# EAGLE design Number (EAGLE 7.3.0)
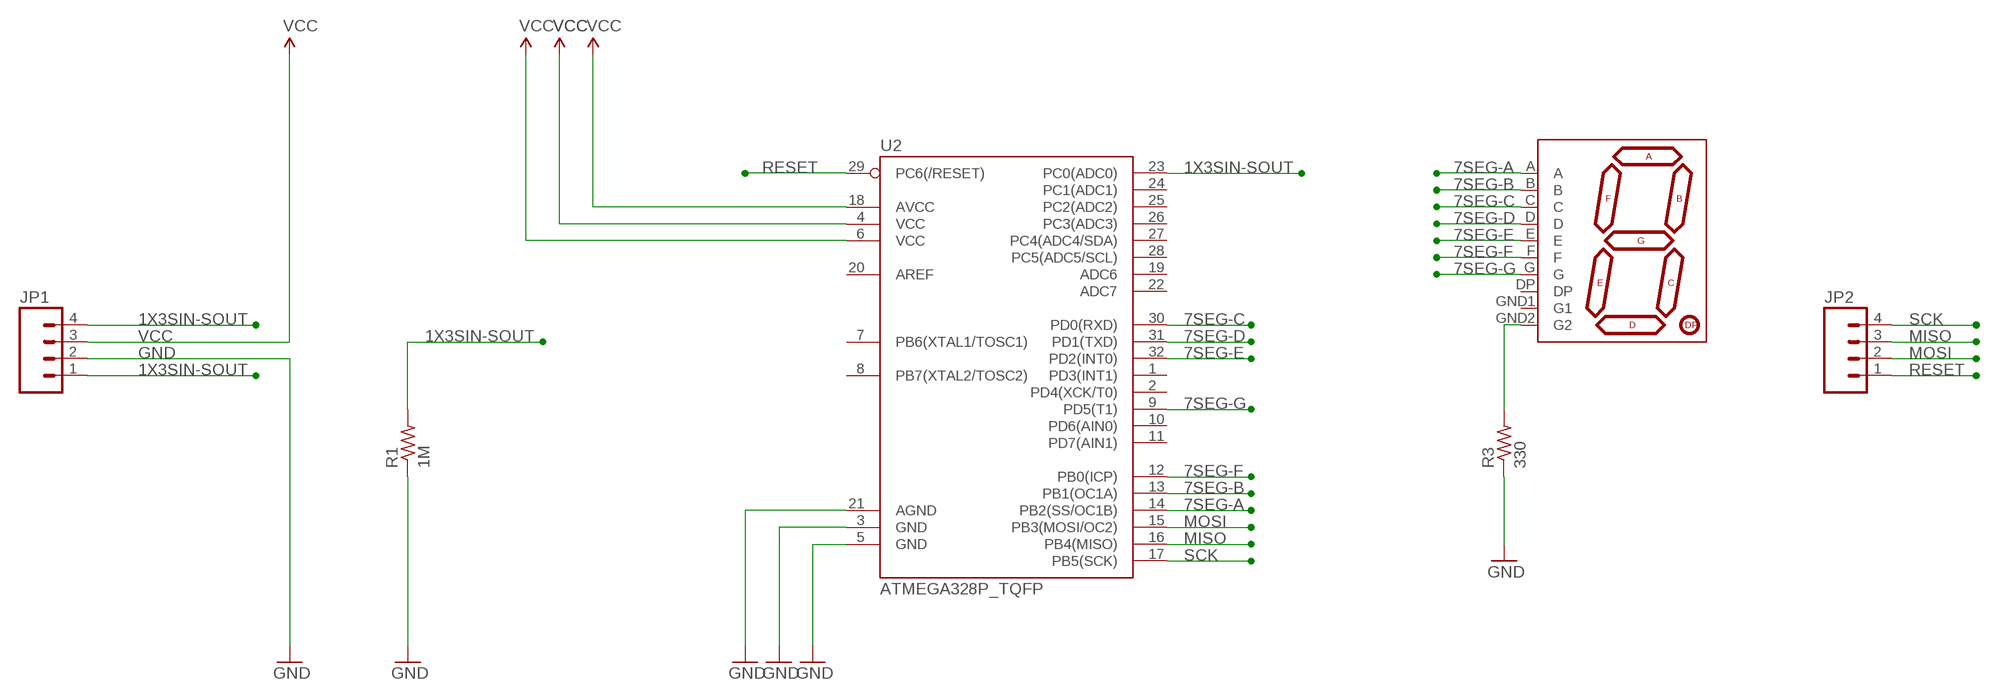
[diagram p0: schematic, sheet 1]

## Parts
JP1  M04PTH  [1X04]
JP2  M04PTH  [1X04]
R1  1M  R-US_R0603  [R0603]
R3  330  R-US_R0603  [R0603]
U2  ATMEGA328P_TQFP  [TQFP32-08]
U$1  7SEGMENT  [7SEG-SMD-10X7.3]

## Nets
1X3SIN-SOUT: JP1.1 JP1.4 R1.2 U2.23(PC0(ADC0))
7SEG-A: U2.14(PB2(SS/OC1B)) U$1.A
7SEG-B: U2.13(PB1(OC1A)) U$1.B
7SEG-C: U2.30(PD0(RXD)) U$1.C
7SEG-D: U2.31(PD1(TXD)) U$1.D
7SEG-E: U2.32(PD2(INT0)) U$1.E
7SEG-F: U2.12(PB0(ICP)) U$1.F
7SEG-G: U2.9(PD5(T1)) U$1.G
GND: JP1.2 R1.1 R3.1 U2.3(GND) U2.5(GND) U2.21(AGND)
MISO: JP2.3 U2.16(PB4(MISO))
MOSI: JP2.2 U2.15(PB3(MOSI/OC2))
N$1: R3.2 U$1.GND2(G2)
RESET: JP2.1 U2.29(PC6(/RESET))
SCK: JP2.4 U2.17(PB5(SCK))
VCC: JP1.3 U2.4(VCC) U2.6(VCC) U2.18(AVCC)
Unconnected: U2.1(PD3(INT1)) U2.2(PD4(XCK/T0)) U2.7(PB6(XTAL1/TOSC1)) U2.8(PB7(XTAL2/TOSC2)) U2.10(PD6(AIN0)) U2.11(PD7(AIN1)) U2.19(ADC6) U2.20(AREF) U2.22(ADC7) U2.24(PC1(ADC1)) U2.25(PC2(ADC2)) U2.26(PC3(ADC3)) U2.27(PC4(ADC4/SDA)) U2.28(PC5(ADC5/SCL)) U$1.DP U$1.GND1(G1)

## Library data of the parts
JP1 JP2 = SparkFun-Connectors:M04: Header 4 Standard 4-pin 0.1" header. Use with straight break away headers (SKU : PRT-00116), right angle break away headers (PRT-00553), swiss pins (PRT-00743), machine pins (PRT-00117), and female headers (PRT-00115). Molex polarized connector foot print use with SKU : PRT-08231 with associated crimp pins and housings. 1MM SMD Version SKU: PRT-10208
R1 = adafruit:R-US_: RESISTOR, American symbol
R3 = resistor:R-US_: RESISTOR, American symbol
U2 = SparkFun-DigitalIC:ATMEGA328P_TQFP; PROD_ID: IC-09069
U$1 = MakerWear:7SEGMENT

## Board
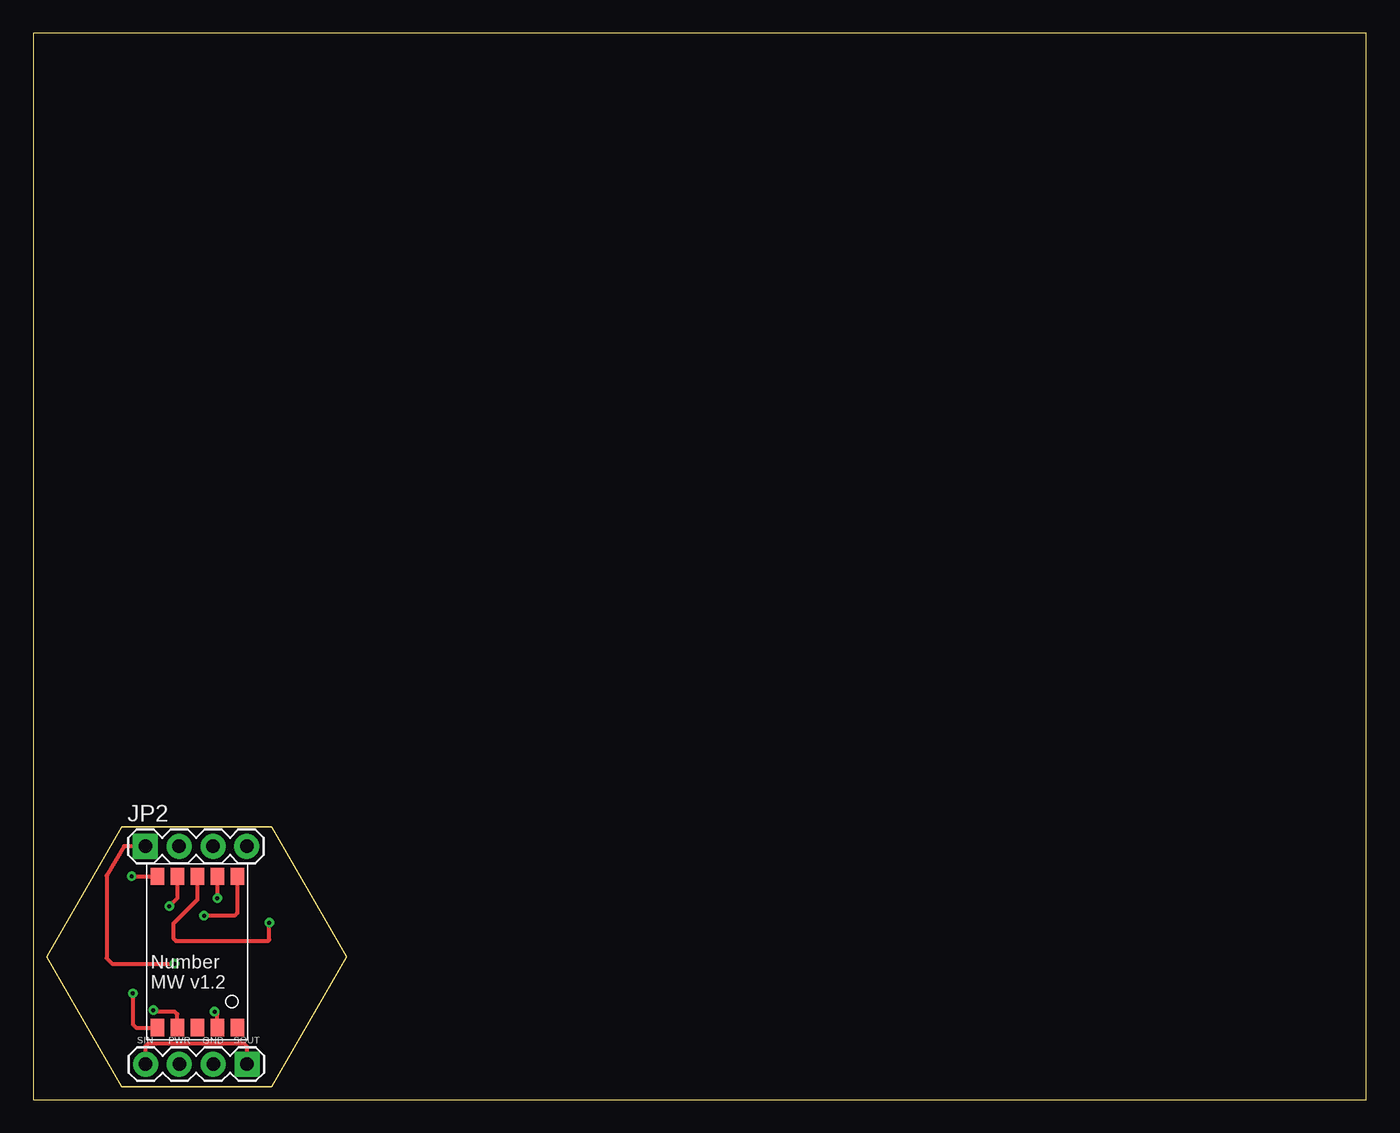
[diagram p1: board, top side]
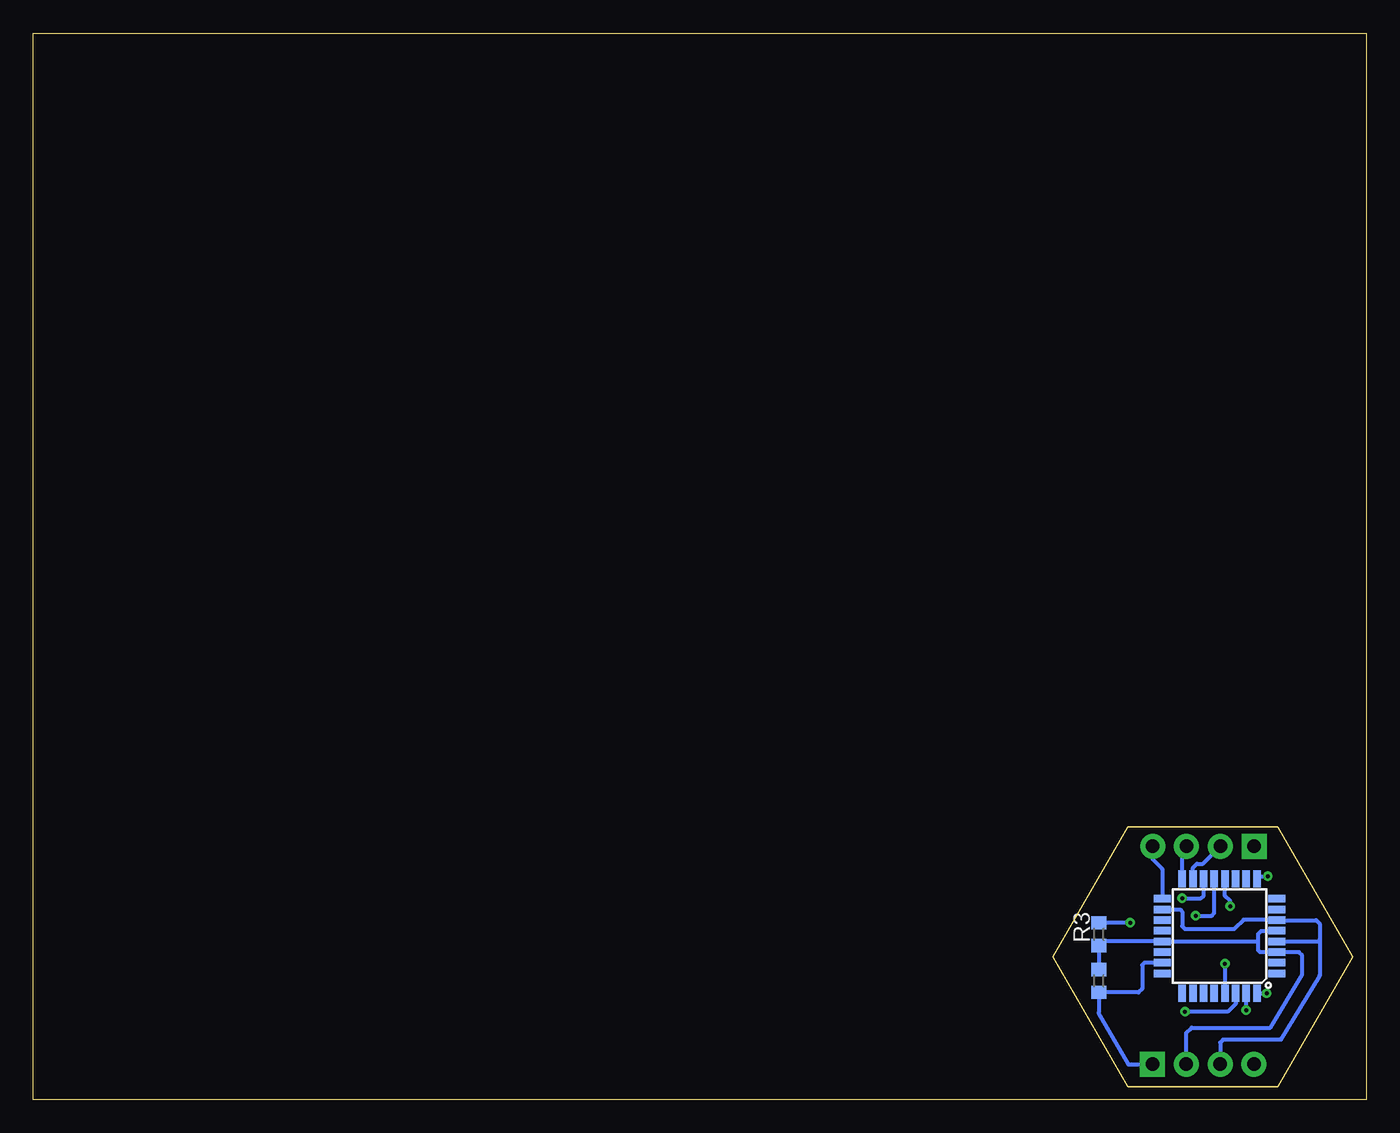
[diagram p2: board, bottom side, seen from below]

Size 100 x 80 mm. Coordinates in mm from the lower left corner, seen from the top.
Outline: 0,0 100,0 100,80 0,80 0,0
Outline: 23.49,10.7 17.86,0.96 6.61,0.96 0.99,10.7 6.61,20.44 17.86,20.44 23.49,10.7
Copper layers (1*16): Top 0.035mm / dielectric 1.5mm / Bottom 0.035mm
Design rules "default *": minimum track width 10mil, minimum drill 24mil, track to track 8mil, track to pad 8mil, pad to pad 8mil, via to via 8mil, smd to smd 8mil, copper to edge 0mil, drill to drill 8mil, minimum pad ring 10mil, minimum via ring 8mil, stop-mask expansion 4mil, vias tented up to drill 0mil, thermal gap 10mil

### Footprints (pad centres in the part's own frame; a part is rotated, then mirrored left to right if it is on the bottom)
1X04 = drill 1.016 pad 1.88 square: 1 0,0 | drill 1.016 pad 1.88: 2 2.54,0; 3 5.08,0; 4 7.62,0
R0603 = smd 1 x 1.1: 1 -0.85,0; 2 0.85,0
TQFP32-08 = smd 1.27 x 0.559: 1 -4.293,2.8; 2 -4.293,2; 3 -4.293,1.2; 4 -4.293,0.4; 5 -4.293,-0.4; 6 -4.293,-1.2; 7 -4.293,-2; 8 -4.293,-2.8; 17 4.293,-2.8; 18 4.293,-2; 19 4.293,-1.2; 20 4.293,-0.4; 21 4.293,0.4; 22 4.293,1.2; 23 4.293,2; 24 4.293,2.8 | smd 0.559 x 1.27: 9 -2.8,-4.293; 10 -2,-4.293; 11 -1.2,-4.293; 12 -0.4,-4.293; 13 0.4,-4.293; 14 1.2,-4.293; 15 2,-4.293; 16 2.8,-4.293; 25 2.8,4.293; 26 2,4.293; 27 1.2,4.293; 28 0.4,4.293; 29 -0.4,4.293; 30 -1.2,4.293; 31 -2,4.293; 32 -2.8,4.293
7SEG-SMD-10X7.3 = smd 1 x 1.3: A 4.5,11.35; B 6,11.35; C 4.5,0; D 1.5,0; DP 6,0; E 0,0; F 1.5,11.35; G 0,11.35; GND1 3,0; GND2 3,11.35

### Placement (x,y rotation side)
JP1  16.04,2.66 180 top
JP2  8.4,19 0 top
R1  20.06,8.9 270 bottom
R3  20.06,12.41 90 bottom
U2  11,12.26 180 bottom
U$1  9.3,5.4 0 top

### Tracks (layer width: path | path; a pad name or v marks a point on that pad's centre or on a via)
1X3SIN-SOUT
  Top 0.305: JP1.1 16.04,3.96 15.8,4.2 8.6,4.2 8.4,4 8.4,2.68 JP1.4
  Bottom 0.305: JP1.1 17.83,2.64 20.08,6.52 20.06,6.54 R1.2 17.08,8.04 16.8,8.32 16.8,10.1 16.64,10.26 U2.23
7SEG-A  (via drill 0.3 pad 0.25)
  Top 0.305: U$1.A v13.8,15.1
  Bottom 0.305: v13.8,15.1 12.4,15.1 12.2,15.3 U2.14
7SEG-B  (via drill 0.3 pad 0.25)
  Top 0.305: U$1.B 15.3,14 15.1,13.8 v12.8,13.8
  Bottom 0.305: v12.8,13.8 11.6,13.8 11.4,14 U2.13
7SEG-C  (via drill 0.3 pad 0.25)
  Top 0.305: U$1.C 13.8,6.4 v13.6,6.6
  Bottom 0.305: U2.30 9.8,7.2 10.4,6.6 v13.6,6.6
7SEG-D  (via drill 0.3 pad 0.25)
  Top 0.305: U$1.D 10.8,6.4 10.6,6.6 9.2,6.6 v9,6.7
  Bottom 0.305: v9,6.7 U2.31
7SEG-E  (via drill 0.3 pad 0.25)
  Top 0.305: v7.46,7.97 7.46,5.64 7.7,5.4 U$1.E
  Bottom 0.305: U2.32 v7.46,7.97
7SEG-F  (via drill 0.3 pad 0.25)
  Top 0.305: U$1.F 10.8,15.1 v10.2,14.5
  Bottom 0.305: v10.2,14.5 10.2,14.9 10.6,15.3 U2.12
7SEG-G  (via drill 0.3 pad 0.25)
  Top 0.305: v7.38,16.75 U$1.G
  Bottom 0.305: U2.9 8.18,16.75 v7.38,16.75
GND
  Bottom 0.305: R1.1 R3.1 19.76,11.86 U2.21 8.16,11.86 8.1,11.8 | 8.1,11.8 8.1,11.2 7.96,11.06 U2.3 6.7,11.05 5.04,11.05 4.8,10.81 4.8,9.4 7.2,5.4 13.1,5.4 13.5,5 JP1.2 | 8.1,11.8 8.1,12.42 7.87,12.65 U2.5
MISO
  Bottom 0.305: U2.16 13.8,18.68 JP2.3
MOSI
  Bottom 0.305: U2.15 13,17.4 12.7,17.7 12.24,17.7 JP2.2
N$1  (via drill 0.3 pad 0.25)
  Top 0.305: U$1.GND2 12.3,15 10.5,13.2 10.5,12.1 10.7,11.9 17.6,11.9 17.7,12 v17.7,13.25 v17.71,13.26
  Bottom 0.305: v17.71,13.26 R3.2
RESET  (via drill 0.3 pad 0.25)
  Top 0.305: JP2.1 6.8,19 5.5,16.8 5.5,10.6 5.9,10.2 v10.59,10.2
  Bottom 0.305: v10.59,10.2 v10.6,10.19 U2.29
SCK
  Bottom 0.305: JP2.4 16.02,18.02 15.3,17.3 U2.17
VCC
  Bottom 0.305: U2.18 13.96,14.26 13.8,14.1 13.8,13 13.6,12.8 9.9,12.8 9.2,13.5 6.75,13.5 U2.6 3.76,13.46 3.5,13.2 3.5,12 | 3.5,12 3.5,9.3 6.4,4.5 10.72,4.5 10.96,4.26 JP1.3 | U2.4 3.64,11.86 3.5,12

### Text on the board
tPlace: Number / MW v1.2 | SIN | PWR | GND | SOUT